# Altium schematic sheet ESP32-WROOM.SchDoc
size A4
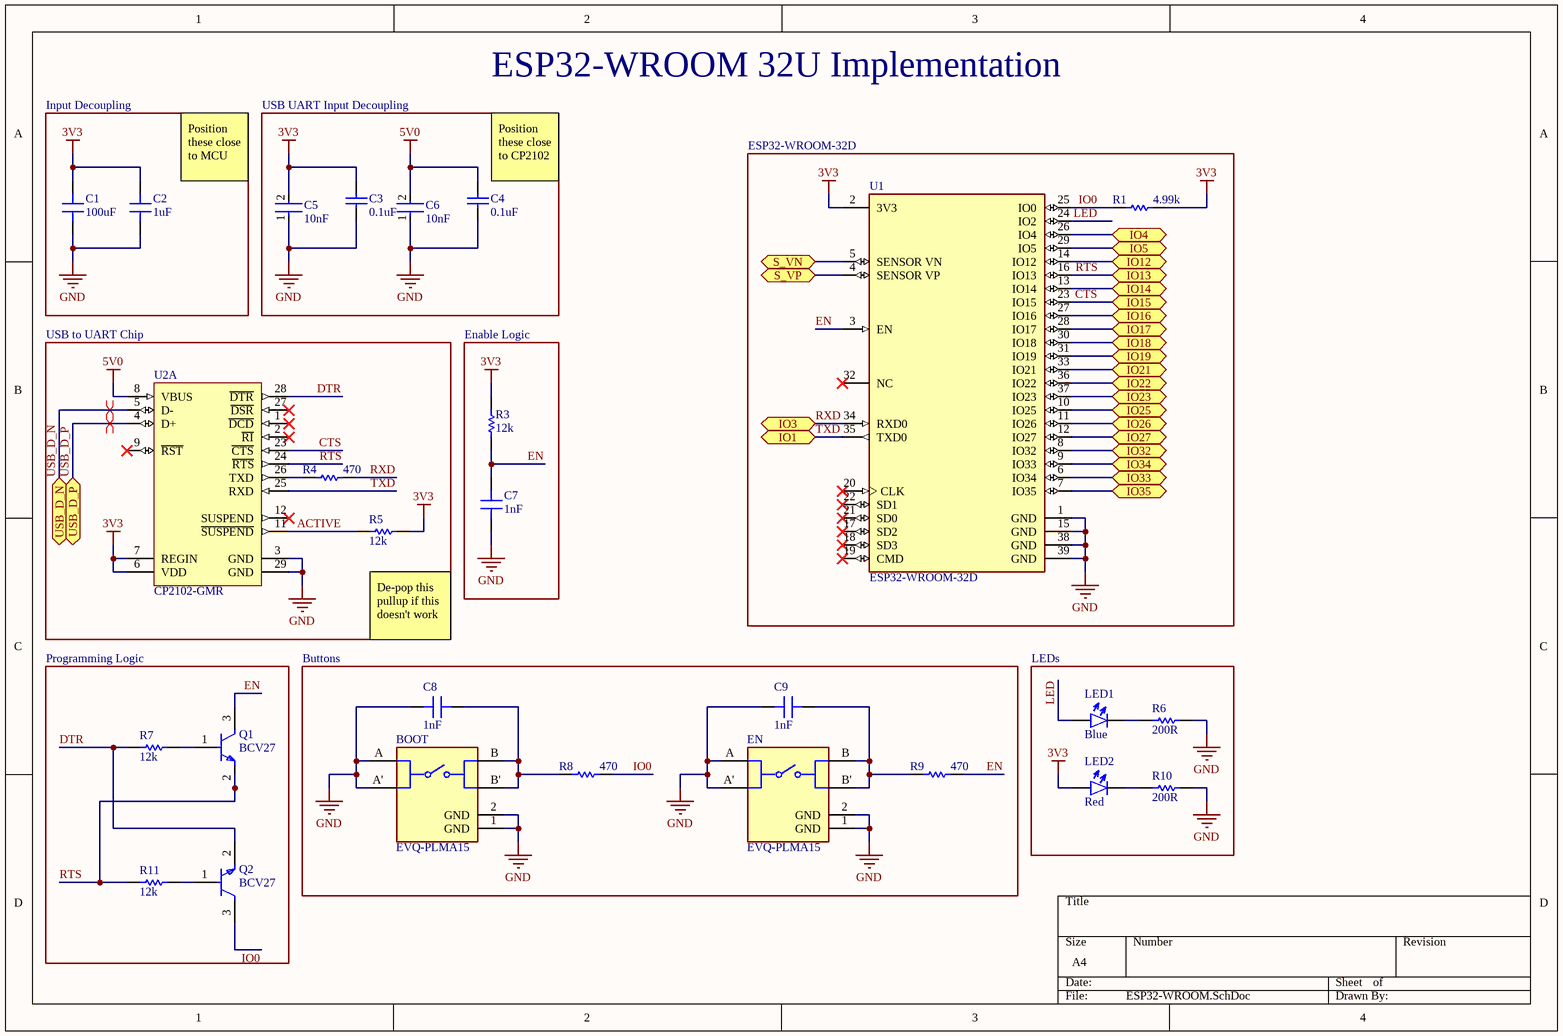
[diagram p0: ESP32-WROOM.SchDoc]

## Parts
BOOT  EVQ-PLMA15  [FP-EVQ-PLMA15-MFG]
C1  100uF  [0805]
C2  1uF  [0805]
C3  0.1uF  [CAPC2013X88X50NL20T25]
C4  0.1uF  [CAPC2013X88X50NL20T25]
C5  10nF  [FP-CL21-IPC_A]
C6  10nF  [FP-CL21-IPC_A]
C7  1nF  [0805]
C8  1nF  [0805]
C9  1nF  [0805]
EN  EVQ-PLMA15  [FP-EVQ-PLMA15-MFG]
LED1  Blue  [0805]
LED2  Red  [0805]
Q1  BCV27  [FP-318-08-MFG]
Q2  BCV27  [FP-318-08-MFG]
R1  4.99k  [0805]
R3  12k  [0805]
R4  470  [0805]
R5  12k  [0805]
R6  200R  [0805]
R7  12k  [0805]
R8  470  [0805]
R9  470  [0805]
R10  200R  [0805]
R11  12k  [0805]
U1  ESP32-WROOM-32D  [FP-ESP32-WROOM-32D-MFG]
U2  CP2102-GMR  [SLAB-QFN-28-3125x3125TP_M]  (part A of 2)

## Blocks framed on the sheet
Input Decoupling: C1 C2
USB UART Input Decoupling: C3-C6
ESP32-WROOM-32D: R1 U1
USB to UART Chip: R4 R5 U2
Enable Logic: C7 R3
Programming Logic: Q1 Q2 R7 R11
Buttons: BOOT C8 C9 EN R8 R9
LEDs: LED1 LED2 R6 R10

## Ports
IO1 (bidir), IO3 (bidir), IO4 (bidir), IO5 (bidir), IO12 (bidir), IO13 (bidir), IO14 (bidir), IO15 (bidir), IO16 (bidir), IO17 (bidir), IO18 (bidir), IO19 (bidir), IO21 (bidir), IO22 (bidir), IO23 (bidir), IO25 (bidir), IO26 (bidir), IO27 (bidir), IO32 (bidir), IO33 (bidir), IO34 (bidir), IO35 (bidir), S_VN (bidir), S_VP (bidir), USB_D_N (bidir), USB_D_P (bidir)

## Nets
3V3: C1.2 C2.2 C3.2 C5.2 LED2.1 R1.2 R3.2 R5.2 U1.2(3V3) U2.6(VDD) U2.7(REGIN)
5V0: C4.2 C6.2 U2.8(VBUS)
GND: BOOT.1(GND) BOOT.2(GND) BOOT.A BOOT.A' C1.1 C2.1 C3.1 C4.1 C5.1 C6.1 C7.1 C8.1 C9.1 EN.1(GND) EN.2(GND) EN.A EN.A' R6.2 R10.2 U1.1(GND) U1.15(GND) U1.38(GND) U1.39(GND) U2.3(GND) U2.29(GND)
ACTIVE: R5.1 U2.11(~{SUSPEND})
CTS: U1.23(IO15) U2.23(~{CTS}) ; port IO15
DTR: Q2.2(E) R7.1 U2.28(~{DTR})
EN: C7.2 Q1.3(C) R3.1 R9.1 U1.3(EN)
IO0: Q2.3(C) R1.1 R8.1 U1.25(IO0)
IO4: U1.26(IO4) ; port IO4
IO5: U1.29(IO5) ; port IO5
IO12: U1.14(IO12) ; port IO12
IO14: U1.13(IO14) ; port IO14
IO16: U1.27(IO16) ; port IO16
IO17: U1.28(IO17) ; port IO17
IO18: U1.30(IO18) ; port IO18
IO19: U1.31(IO19) ; port IO19
IO21: U1.33(IO21) ; port IO21
IO22: U1.36(IO22) ; port IO22
IO23: U1.37(IO23) ; port IO23
IO25: U1.10(IO25) ; port IO25
IO26: U1.11(IO26) ; port IO26
IO27: U1.12(IO27) ; port IO27
IO32: U1.8(IO32) ; port IO32
IO33: U1.6(IO34) ; port IO33
IO34: U1.9(IO33) ; port IO34
IO35: U1.7(IO35) ; port IO35
LED: LED1.1 U1.24(IO2)
RTS: Q1.2(E) R11.1 U1.16(IO13) U2.24(~{RTS}) ; port IO13
RXD: R4.1 U1.34(RXD0) ; port IO3
S_VN: U1.5(SENSOR_VN) ; port S_VN
S_VP: U1.4(SENSOR_VP) ; port S_VP
TXD: U1.35(TXD0) U2.25(RXD) ; port IO1
USB_D_N: U2.5(D-) ; port USB_D_N
USB_D_P: U2.4(D+) ; port USB_D_P
NetBOOT_B: BOOT.B BOOT.B' C8.2 R8.2
NetC9_2: C9.2 EN.B EN.B' R9.2
NetLED1_2: LED1.2 R6.1
NetLED2_2: LED2.2 R10.1
NetQ1_1: Q1.1(B) R7.2
NetQ2_1: Q2.1(B) R11.2
NetR4_2: R4.2 U2.26(TXD)

Not connected (* = marked no-connect by the designer): U1 17(SD2)* 18(SD3)* 19(CMD)* 20(CLK)* 21(SD0)* 22(SD1)* 32(NC)*; U2 1(~{DCD})* 2(~{RI})* 9(~{RST})* 12(SUSPEND)* 27(~{DSR})*

## Layout directives
differential pair: USB_D_N, USB_D_P

## Notes on the sheet
- ESP32-WROOM 32U Implementation
- Position these close to MCU
- (near C4) Position these close to CP2102
- (near R5) De-pop this pullup if this doesn't work

## Library data of the parts
BOOT EN = CMP-05618-000006-1: SWITCH TACTILE SPST-NO 0.02A 15V; Manufacturer: Panasonic Electronic Components; Operating Force: 2.6N; Contact Resistance: 50mΩ; Contact Current Rating: 20mA; Electromechanical Life: 200000Cycles; Illumination Type: Non-Illuminated,Illuminated; Switch Function: Off-Mom; Switch Travel: 0.25mm; Actuator Type: Standard; Insulation Resistance: 50MR; Actuator Length: 0.3mm; Throw Configuration: SPST-NO; Automotive: No; Digikey Description: SWITCH TACTILE SPST-NO 0.02A 15V; Device Class L3: Tactile Switches; Device Class L2: Switches; Temperature Range Low: -20°C; ComponentLink2Description: Datasheet; RoHS: TRUE; Mount: Surface Mount; Package: 0; Height: 1.7mm; Octopart: https://octopart.com/evq-plma15-panasonic-39850235; Temperature Range High: +70°C; Device Class L1: Electromechanical; Category: Switch; Mouser Description: Tactile Switches FLAT ACT 2.6NF 4.6x3.4x1.5mm; Voltage Rating Dc: 15V; Manufacturer Part Number: EVQ-PLMA15; ComponentLink2URL: https://datasheet.ciiva.com/8164/atv0000ce2-8164994.pdf; Lead Free: Yes; Temperature: -20°C to +70°C; Supplier 1: LCSC; Supplier Part Number 1: C128538; Stock 1: 8546; Pricing 1: 1=0.21470, 10=0.16010, 30=0.15000, 100=0.14000, 500=0.13560, 1000=0.13340, 1=0.20650, 10=0.15390, 30=0.14430, 100=0.13470, 500=0.13040, 1000=0.12830, 1=1.06470, 10=0.79390, 30=0.74410, 100=0.69450, 500=0.67240, 1000=0.66140, 1=0.98240, 10=0.73260, 30=0.68660, 100=0.64080, 500=0.62040, 1000=0.61030, 1=0.13200, 10=0.09850, 30=0.09230, 100=0.08610, 500=0.08340, 1000=0.08200, 1=0.12220, 10=0.09110, 30=0.08540, 100=0.07970, 500=0.07720, 1000=0.07590, 1=1.21530, 10=0.90620, 30=0.84940, 100=0.79270, 500=0.76750, 1000=0.75500, 1=16.57020, 10=12.35580, 30=11.58100, 100=10.80780, 500=10.46440, 1000=10.29370, 1=0.64910, 10=0.48400, 30=0.45370, 100=0.42340, 500=0.40990, 1000=0.40330, 1=11.79630, 10=8.79610, 30=8.24450, 100=7.69410, 500=7.44960, 1000=7.32800, 1=1.37520, 10=1.02550, 30=0.96110, 100=0.89700, 500=0.86850, 1000=0.85430, 1=0.21370, 10=0.15930, 30=0.14930, 100=0.13940, 500=0.13490, 1000=0.13270, 1=0.15682, 10=0.11693, 30=0.10960, 100=0.10228, 500=0.09903, 1000=0.09742 (AUD); Mechanical Life: 200000Cycles; Contact Plating: Gold,Silver; Min Operating Temperature: -20°C; Max Operating Temperature: 70°C; Packaging: Tape and Reel; Voltage Rating (DC): 15V; Package Quantity: 1; Max Voltage Rating (DC): 15V; Termination: J-Bend; Orientation: Straight; Current Rating: 20mA; Max Current Rating: 20mA; Electrical Life: 200000Cycles; Voltage Rating: 15V; Length: 4.9mm; Depth: 4.9mm; Width: 4.9mm; Radiation Hardening: No; REACH SVHC: No SVHC; ComponentLink1URL: https://datasheet.ciiva.com/8164/atv0000ce2-8164994.pdf?src-supplier=Avnet; ComponentLink1Description: https://datasheet.ciiva.com/8164/atv0000ce2-8164994.pdf?src-supplier=Avnet; ComponentLink3URL: https://datasheet.ciiva.com/16205/atk0000ce3-16205767.pdf?src-supplier=Future+Electronics; ComponentLink3Description: https://datasheet.ciiva.com/16205/atk0000ce3-16205767.pdf?src-supplier=Future+Electronics; ComponentLink4URL: https://datasheet.ciiva.com/17065/70270715-17065721.pdf?src-supplier=Allied+Electronics; ComponentLink4Description: https://datasheet.ciiva.com/17065/70270715-17065721.pdf?src-supplier=Allied+Electronics; ComponentLink5URL: https://datasheet.ciiva.com/2899/atk0000ce3-2899834.pdf?src-supplier=Digi-Key; ComponentLink5Description: https://datasheet.ciiva.com/2899/atk0000ce3-2899834.pdf?src-supplier=Digi-Key; ComponentLink6URL: https://datasheet.ciiva.com/2899/atk0000ce3-2899836.pdf?src-supplier=Digi-Key; ComponentLink6Description: https://datasheet.ciiva.com/2899/atk0000ce3-2899836.pdf?src-supplier=Digi-Key; ComponentLink7URL: https://datasheet.ciiva.com/26827/getdatasheetpartid-51835-26827884.pdf?src-supplier=Verical; ComponentLink7Description: https://datasheet.ciiva.com/26827/getdatasheetpartid-51835-26827884.pdf?src-supplier=Verical; ComponentLink8URL: https://datasheet.ciiva.com/2899/atk0000ce3-2899835.pdf?src-supplier=Digi-Key; ComponentLink8Description: https://datasheet.ciiva.com/2899/atk0000ce3-2899835.pdf?src-supplier=Digi-Key; Supplier 2: Digi-Key; Supplier Part Number 2: P8047SCT-ND; Stock 2: 25001; Pricing 2: 1=0.36000, 10=0.35000, 25=0.32920, 100=0.28580, 250=0.25928, 500=0.24120, 1000=0.21708, 2500=0.20382 (USD)
C1 = Capacitor - Ceramic: MURATA - GRM31CR60J107ME39L - SMD Multilayer Ceramic Capacitor, 100 µF, 6.3 V, 1206 [3216 Metric], ± 20%, X5R, GRM Series; Voltage Rating: 6.3V; Value: 100uF; Supplier 1: LCSC; Supplier Part Number 1: C77085; Manufacturer: Murata; Manufacturer Part Number: GRM31CR60J107ME39L; RoHS: Yes; Category: Ceramic Capacitors; Stock 1: 51728; Pricing 1: 1=0.20990, 10=0.15190, 30=0.14130, 100=0.13070, 500=0.12590, 1000=0.12360, 1=0.20040, 10=0.14510, 30=0.13490, 100=0.12480, 500=0.12030, 1000=0.11800, 1=1.02030, 10=0.73860, 30=0.68690, 100=0.63510, 500=0.61220, 1000=0.60080, 1=0.94960, 10=0.68740, 30=0.63930, 100=0.59110, 500=0.56970, 1000=0.55920, 1=0.12750, 10=0.09230, 30=0.08590, 100=0.07940, 500=0.07650, 1000=0.07510, 1=0.11640, 10=0.08430, 30=0.07840, 100=0.07250, 500=0.06990, 1000=0.06860, 1=1.16060, 10=0.84010, 30=0.78140, 100=0.72250, 500=0.69640, 1000=0.68340, 1=15.82710, 10=11.45680, 30=10.65540, 100=9.85210, 500=9.49630, 1000=9.32010, 1=0.62240, 10=0.45060, 30=0.41900, 100=0.38750, 500=0.37350, 1000=0.36650, 1=11.81250, 10=8.55070, 30=7.95260, 100=7.35310, 500=7.08750, 1000=6.95600, 1=1.34210, 10=0.97150, 30=0.90360, 100=0.83540, 500=0.80530, 1000=0.79030, 1=0.20480, 10=0.14830, 30=0.13790, 100=0.12750, 500=0.12290, 1000=0.12060, 1=0.14975, 10=0.10840, 30=0.10082, 100=0.09322, 500=0.08985, 1000=0.08818 (AUD); Mount: Surface Mount; Case/Package: 1206; Case Code (Imperial): 1206; Case Code (Metric): 3216; Material: Ceramic; Min Operating Temperature: -55°C; Max Operating Temperature: 85°C; Capacitance: 100uF; Tolerance: 20%; Packaging: Tape and Reel; Voltage Rating (DC): 6.3V; Package Quantity: 1; Termination: SMD/SMT; Voltage: 6.3V; Dielectric: X5R; Length: 3.2mm; Height: 1.6mm; Width: 1.6mm; Depth: 1.6mm; Thickness: 0.071inch; Radiation Hardening: No; REACH SVHC: No SVHC; Lead Free: Lead Free; ComponentLink1URL: https://datasheet.ciiva.com/11787/0900766b80ef921d-11787809.pdf?src-supplier=RSComponents; ComponentLink1Description: https://datasheet.ciiva.com/11787/0900766b80ef921d-11787809.pdf?src-supplier=RSComponents; ComponentLink2URL: https://datasheet.ciiva.com/142/grm31cr60j107me39-01-142571.pdf?src-supplier=Digi-Key; ComponentLink2Description: https://datasheet.ciiva.com/142/grm31cr60j107me39-01-142571.pdf?src-supplier=Digi-Key; ComponentLink3URL: https://datasheet.ciiva.com/142/grm31cr60j107me39-01-142572.pdf?src-supplier=Digi-Key; ComponentLink3Description: https://datasheet.ciiva.com/142/grm31cr60j107me39-01-142572.pdf?src-supplier=Digi-Key; ComponentLink4URL: https://datasheet.ciiva.com/3776/255grm31cr60j107me3923-3776999.pdf?src-supplier=Arrow+Electronics; ComponentLink4Description: https://datasheet.ciiva.com/3776/255grm31cr60j107me3923-3776999.pdf?src-supplier=Arrow+Electronics; ComponentLink5URL: https://datasheet.ciiva.com/29199/454804-da-01-en-vs-kondensator-1206-29199543.pdf?src-supplier=Conrad; ComponentLink5Description: https://datasheet.ciiva.com/29199/454804-da-01-en-vs-kondensator-1206-29199543.pdf?src-supplier=Conrad; ComponentLink6URL: https://datasheet.ciiva.com/29202/451152-da-01-de-vs-chip-kond-1206-100-0-uf-20pr-6-3v-x5r-29202463.pdf?src-supplier=Conrad; ComponentLink6Description: https://datasheet.ciiva.com/29202/451152-da-01-de-vs-chip-kond-1206-100-0-uf-20pr-6-3v-x5r-29202463.pdf?src-supplier=Conrad; ComponentLink7URL: https://datasheet.ciiva.com/5416/product-5416441.pdf?src-supplier=Mouser; ComponentLink7Description: https://datasheet.ciiva.com/5416/product-5416441.pdf?src-supplier=Mouser; ComponentLink8URL: https://datasheet.ciiva.com/142/grm31cr60j107me39-01-142570.pdf?src-supplier=Digi-Key; ComponentLink8Description: https://datasheet.ciiva.com/142/grm31cr60j107me39-01-142570.pdf?src-supplier=Digi-Key; ComponentLink9URL: https://datasheet.ciiva.com/16461/product-16461259.pdf?src-supplier=Future+Electronics; ComponentLink9Description: https://datasheet.ciiva.com/16461/product-16461259.pdf?src-supplier=Future+Electronics; ComponentLink10URL: https://datasheet.ciiva.com/14116/grmseries-highdielectrictype-eng-14116431.pdf?src-supplier=Distrelec; ComponentLink10Description: https://datasheet.ciiva.com/14116/grmseries-highdielectrictype-eng-14116431.pdf?src-supplier=Distrelec; Supplier 2: Digi-Key; Supplier Part Number 2: 490-4539-1-ND; Stock 2: 1324719; Pricing 2: 1=0.86000, 10=0.65200, 50=0.54180, 100=0.46650, 500=0.36118, 1000=0.31101 (USD)
C2 = Capacitor - Ceramic: SAMSUNG ELECTRO-MECHANICS - CL21B105KOFNNNE - CERAMIC MULTILAYER MLCC CAPACITORS- SMD; Tolerance: 10%; Voltage Rating: 16V; Dielectric: X7R; Value: 1uF; Supplier 1: LCSC; Supplier Part Number 1: C24123; Manufacturer: Samsung; Manufacturer Part Number: CL21B105KOFNNNE; RoHS: Yes; Category: Ceramic Capacitors; Stock 1: 77650; Pricing 1: 50=0.02130, 500=0.01590, 1500=0.01490, 5000=0.01400, 25000=0.01350, 50000=0.01330, 50=0.02010, 500=0.01500, 1500=0.01410, 5000=0.01310, 25000=0.01270, 50000=0.01250, 50=0.10220, 500=0.07640, 1500=0.07170, 5000=0.06700, 25000=0.06480, 50000=0.06380, 50=0.09590, 500=0.07170, 1500=0.06720, 5000=0.06280, 25000=0.06080, 50000=0.05990, 50=0.01290, 500=0.00960, 1500=0.00900, 5000=0.00840, 25000=0.00820, 50000=0.00800, 50=0.01180, 500=0.00880, 1500=0.00820, 5000=0.00770, 25000=0.00750, 50000=0.00730, 50=0.11610, 500=0.08680, 1500=0.08140, 5000=0.07600, 25000=0.07360, 50000=0.07250, 50=1.58180, 500=1.18260, 1500=1.10930, 5000=1.03610, 25000=1.00340, 50000=0.98740, 50=0.06250, 500=0.04670, 1500=0.04380, 5000=0.04090, 25000=0.03960, 50000=0.03900, 50=1.17060, 500=0.87520, 1500=0.82100, 5000=0.76680, 25000=0.74260, 50000=0.73080, 50=0.13680, 500=0.10230, 1500=0.09600, 5000=0.08960, 25000=0.08680, 50000=0.08540, 50=0.02060, 500=0.01540, 1500=0.01450, 5000=0.01350, 25000=0.01310, 50000=0.01290, 50=0.01498, 500=0.01120, 1500=0.01051, 5000=0.00981, 25000=0.00950, 50000=0.00935 (AUD); Mount: Surface Mount; Case/Package: 0805; Case Code (Metric): 2012; Case Code (Imperial): 0805; Contact Plating: Tin; Min Operating Temperature: -55°C; Max Operating Temperature: 125°C; Package Quantity: 1; Packaging: Tape and Reel; Capacitance: 1uF; Voltage Rating (DC): 16V; Voltage: 16V; Length: 2mm; Height: 1.25mm; Width: 0.049inch; Depth: 1.25mm; Thickness: 0.053inch; Radiation Hardening: No; Lead Free: Lead Free; ComponentLink1URL: https://datasheet.ciiva.com/25800/cl21b105kofnnne-25800257.pdf?src-supplier=Digi-Key; ComponentLink1Description: https://datasheet.ciiva.com/25800/cl21b105kofnnne-25800257.pdf?src-supplier=Digi-Key; ComponentLink2URL: https://datasheet.ciiva.com/26838/getdatasheetpartid-358361-26838673.pdf?src-supplier=Verical; ComponentLink2Description: https://datasheet.ciiva.com/26838/getdatasheetpartid-358361-26838673.pdf?src-supplier=Verical; ComponentLink3URL: https://datasheet.ciiva.com/26310/mlcc-catalogdownload2013-eng-26310166.pdf?src-supplier=Distrelec; ComponentLink3Description: https://datasheet.ciiva.com/26310/mlcc-catalogdownload2013-eng-26310166.pdf?src-supplier=Distrelec; Supplier 2: Digi-Key; Supplier Part Number 2: 1276-1026-1-ND; Stock 2: 1444; Pricing 2: 1=0.10000, 10=0.05500, 50=0.03000, 100=0.02450, 500=0.01748, 1000=0.01373 (USD)
C3 C4 = CMP-2007-00279-1: Part Number: C0805C104K5RACTU; Manufacturer: Kemet; Dielectric Material: Ceramic; Capacitance: 100nF; Tolerance: 10%; Voltage Rating: 50V; Dielectric: X7R; Voltage: 500V; Supplier 1: LCSC; Supplier Part Number 1: C129690; Manufacturer Part Number: C0805C104K5RACTU; RoHS: Yes; Category: Ceramic Capacitors; Stock 1: 744050; Pricing 1: 50=0.02360, 500=0.01780, 1500=0.01680, 5000=0.01570, 25000=0.01530, 50000=0.01500, 50=0.02250, 500=0.01700, 1500=0.01600, 5000=0.01500, 25000=0.01460, 50000=0.01430, 50=0.11760, 500=0.08890, 1500=0.08370, 5000=0.07840, 25000=0.07610, 50000=0.07490, 50=0.10700, 500=0.08090, 1500=0.07610, 5000=0.07130, 25000=0.06920, 50000=0.06810, 50=0.01440, 500=0.01090, 1500=0.01020, 5000=0.00960, 25000=0.00930, 50000=0.00920, 50=0.01310, 500=0.00990, 1500=0.00930, 5000=0.00870, 25000=0.00850, 50000=0.00830, 50=0.13020, 500=0.09850, 1500=0.09270, 5000=0.08680, 25000=0.08420, 50000=0.08300, 50=1.77600, 500=1.34310, 1500=1.26360, 5000=1.18400, 25000=1.14870, 50000=1.13130, 50=0.07150, 500=0.05410, 1500=0.05090, 5000=0.04770, 25000=0.04620, 50000=0.04550, 50=1.20420, 500=0.91060, 1500=0.85670, 5000=0.80280, 25000=0.77880, 50000=0.76700, 50=0.14790, 500=0.11180, 1500=0.10520, 5000=0.09860, 25000=0.09570, 50000=0.09420, 50=0.02320, 500=0.01750, 1500=0.01650, 5000=0.01550, 25000=0.01500, 50000=0.01480, 50=0.01680, 500=0.01271, 1500=0.01196, 5000=0.01120, 25000=0.01087, 50000=0.01070 (AUD); Mount: Surface Mount,PCB; Case/Package: 0805; Number of Pins: 2; Case Code (Imperial): 0805; Case Code (Metric): 2012; Contact Plating: Tin,Matte; Min Operating Temperature: -55°C; Max Operating Temperature: 125°C; Packaging: Tape and Reel; Termination: SMD/SMT; Package Quantity: 4000; Voltage Rating (DC): 50V; Length: 2mm; Height: 0.9mm; Depth: 1.25mm; Width: 1.2mm; Thickness: 0.035inch; Lead Pitch: 0.75mm; Radiation Hardening: No; REACH SVHC: No SVHC; ComponentLink1URL: https://datasheet.ciiva.com/14589/70095383-14589048.pdf?src-supplier=Allied+Electronics; ComponentLink1Description: https://datasheet.ciiva.com/14589/70095383-14589048.pdf?src-supplier=Allied+Electronics; ComponentLink2URL: https://datasheet.ciiva.com/28682/1851736-28682232.pdf?src-supplier=Element14; ComponentLink2Description: https://datasheet.ciiva.com/28682/1851736-28682232.pdf?src-supplier=Element14; ComponentLink3URL: https://datasheet.ciiva.com/32431/slceramic-chip-condensers-e-32431755.pdf?src-supplier=Distrelec; ComponentLink3Description: https://datasheet.ciiva.com/32431/slceramic-chip-condensers-e-32431755.pdf?src-supplier=Distrelec; ComponentLink4URL: https://datasheet.ciiva.com/18410/70095383-18410815.pdf?src-supplier=Allied+Electronics; ComponentLink4Description: https://datasheet.ciiva.com/18410/70095383-18410815.pdf?src-supplier=Allied+Electronics; Supplier 2: Digi-Key; Supplier Part Number 2: 399-1170-1-ND; Stock 2: 2736847; Pricing 2: 1=0.16000, 10=0.11500, 50=0.06540, 100=0.05420, 500=0.03802, 1000=0.03147 (USD)
C5 C6 = CMP-13271-003077-1: CL21 Series 0805 10nF 100V ±10% Tolerance X7R Multilayer Ceramic Chip Capacitor; Manufacturer: Samsung; Manufacturer Part Number: CL21B103KCANNNC; Voltage: 100V; Contact Plating: Tin; Height: 0.65mm; Thickness: 0.03inch; Min Operating Temperature: -55°C; Capacitance: 10nF; Length: 2mm; Max Operating Temperature: 125°C; Case Code (Imperial): 0805; Radiation Hardening: No; Dielectric: X7R; Material: Ceramic; Depth: 1.25mm; Voltage Rating: 100V; Case/Package: 0805; Tolerance: 10%; Package Quantity: 1; Width: 0.049inch; Mount: Surface Mount; Case Code (Metric): 2012; Packaging: Tape and Reel; Supplier 1: LCSC; Supplier Part Number 1: C18741; RoHS: Yes; Category: Ceramic Capacitors; Stock 1: 16900; Pricing 1: 50=0.01480, 500=0.01090, 1500=0.01020, 5000=0.00950, 25000=0.00920, 50000=0.00910, 50=0.01420, 500=0.01050, 1500=0.00990, 5000=0.00920, 25000=0.00890, 50000=0.00870, 50=0.07310, 500=0.05410, 1500=0.05060, 5000=0.04710, 25000=0.04560, 50000=0.04480, 50=0.06800, 500=0.05030, 1500=0.04700, 5000=0.04380, 25000=0.04230, 50000=0.04160, 50=0.00910, 500=0.00680, 1500=0.00630, 5000=0.00590, 25000=0.00570, 50000=0.00560, 50=0.00840, 500=0.00620, 1500=0.00580, 5000=0.00540, 25000=0.00520, 50000=0.00510, 50=0.08390, 500=0.06200, 1500=0.05800, 5000=0.05400, 25000=0.05230, 50000=0.05140, 50=1.13470, 500=0.83950, 1500=0.78530, 5000=0.73100, 25000=0.70690, 50000=0.69500, 50=0.04470, 500=0.03300, 1500=0.03090, 5000=0.02880, 25000=0.02780, 50000=0.02740, 50=0.81170, 500=0.60050, 1500=0.56170, 5000=0.52290, 25000=0.50570, 50000=0.49710, 50=0.09500, 500=0.07020, 1500=0.06570, 5000=0.06120, 25000=0.05920, 50000=0.05820, 50=0.01470, 500=0.01090, 1500=0.01020, 5000=0.00950, 25000=0.00910, 50000=0.00900, 50=0.01082, 500=0.00801, 1500=0.00749, 5000=0.00697, 25000=0.00674, 50000=0.00663 (AUD); ComponentLink1URL: https://datasheet.ciiva.com/15195/getdatasheetpartid-494350-15195869.pdf?src-supplier=Verical; ComponentLink1Description: https://datasheet.ciiva.com/15195/getdatasheetpartid-494350-15195869.pdf?src-supplier=Verical; ComponentLink2URL: https://datasheet.ciiva.com/29199/455069-da-01-en-vs-kondensator-0805-29199454.pdf?src-supplier=Conrad; ComponentLink2Description: https://datasheet.ciiva.com/29199/455069-da-01-en-vs-kondensator-0805-29199454.pdf?src-supplier=Conrad; ComponentLink3URL: https://datasheet.ciiva.com/26310/mlcc-catalogdownload2013-eng-26310214.pdf?src-supplier=Distrelec; ComponentLink3Description: https://datasheet.ciiva.com/26310/mlcc-catalogdownload2013-eng-26310214.pdf?src-supplier=Distrelec; ComponentLink4URL: https://datasheet.ciiva.com/16351/cl21b103kcannnc-16351132.pdf?src-supplier=Future+Electronics; ComponentLink4Description: https://datasheet.ciiva.com/16351/cl21b103kcannnc-16351132.pdf?src-supplier=Future+Electronics; Supplier 2: Digi-Key; Supplier Part Number 2: 1276-1249-1-ND; Stock 2: 123647; Pricing 2: 1=0.10000, 10=0.03900, 50=0.02140, 100=0.01740, 500=0.01244, 1000=0.00977 (USD)
C7-C9 = Capacitor - Ceramic: SAMSUNG ELECTRO-MECHANICS - CL21B102KCANNNC - SMD Multilayer Ceramic Capacitor, 1000 pF, 100 V, 0805 [2012 Metric], ± 10%, X7R, CL Series; Voltage Rating (DC): 100V; Value: 1nF; Supplier 1: LCSC; Supplier Part Number 1: C15177; Manufacturer: Samsung; Manufacturer Part Number: CL21B102KCANNNC; RoHS: Yes; Category: Ceramic Capacitors; Stock 1: 341000; Pricing 1: 50=0.01320, 500=0.00960, 1500=0.00900, 5000=0.00830, 25000=0.00800, 50000=0.00790, 50=0.01240, 500=0.00910, 1500=0.00840, 5000=0.00780, 25000=0.00750, 50000=0.00740, 50=0.06330, 500=0.04620, 1500=0.04300, 5000=0.03990, 25000=0.03850, 50000=0.03780, 50=0.05940, 500=0.04330, 1500=0.04030, 5000=0.03740, 25000=0.03610, 50000=0.03540, 50=0.00800, 500=0.00580, 1500=0.00540, 5000=0.00500, 25000=0.00480, 50000=0.00480, 50=0.00730, 500=0.00530, 1500=0.00490, 5000=0.00460, 25000=0.00440, 50000=0.00430, 50=0.07190, 500=0.05240, 1500=0.04890, 5000=0.04530, 25000=0.04370, 50000=0.04290, 50=0.97930, 500=0.71430, 1500=0.66560, 5000=0.61710, 25000=0.59540, 50000=0.58480, 50=0.03870, 500=0.02820, 1500=0.02630, 5000=0.02440, 25000=0.02350, 50000=0.02310, 50=0.72470, 500=0.52870, 1500=0.49260, 5000=0.45670, 25000=0.44070, 50000=0.43280, 50=0.08470, 500=0.06180, 1500=0.05760, 5000=0.05340, 25000=0.05150, 50000=0.05060, 50=0.01280, 500=0.00930, 1500=0.00870, 5000=0.00810, 25000=0.00780, 50000=0.00760, 50=0.00927, 500=0.00677, 1500=0.00630, 5000=0.00584, 25000=0.00564, 50000=0.00554 (AUD); Mount: Surface Mount; Case/Package: 0805; Case Code (Metric): 2012; Case Code (Imperial): 0805; Material: Ceramic; Min Operating Temperature: -55°C; Max Operating Temperature: 125°C; Dielectric: X7R; Tolerance: 10%; Packaging: Tape and Reel; Capacitance: 1nF; Voltage Rating: 100V; Package Quantity: 1; Voltage: 100V; Length: 2mm; Height: 0.65mm; Depth: 1.25mm; Thickness: 0.03inch; Width: 0.049inch; Radiation Hardening: No; Lead Free: Lead Free; ComponentLink1URL: https://datasheet.ciiva.com/26878/getdatasheetpartid-643098-26878049.pdf?src-supplier=Verical; ComponentLink1Description: https://datasheet.ciiva.com/26878/getdatasheetpartid-643098-26878049.pdf?src-supplier=Verical; ComponentLink2URL: https://datasheet.ciiva.com/29199/456063-da-01-en-vs-kondensator-0805-29199067.pdf?src-supplier=Conrad; ComponentLink2Description: https://datasheet.ciiva.com/29199/456063-da-01-en-vs-kondensator-0805-29199067.pdf?src-supplier=Conrad; ComponentLink3URL: https://datasheet.ciiva.com/26310/mlcc-catalogdownload2013-eng-26310183.pdf?src-supplier=Distrelec; ComponentLink3Description: https://datasheet.ciiva.com/26310/mlcc-catalogdownload2013-eng-26310183.pdf?src-supplier=Distrelec; Supplier 2: Digi-Key; Supplier Part Number 2: 1276-1169-1-ND; Stock 2: 91657; Pricing 2: 1=0.10000, 10=0.04700, 50=0.02540, 100=0.02080, 500=0.01482, 1000=0.01165 (USD)
LED1 = LED: Forward Voltage: 2.7; Current: 20mA; Color: Blue; Supplier 1: LCSC; Supplier Part Number 1: C84259
LED2 = LED: Forward Voltage: 2.4; Current: 25; Color: Red; Supplier 1: LCSC; Supplier Part Number 1: C72037
Q1 Q2 = CMP-07170-000025-1: TRANS NPN DARL 30V 1.2A SOT23; Manufacturer: ON Semiconductor / Fairchild; Max Power Dissipation: 350mW; Emitter Base Voltage (VEBO): 10V; Transition Frequency: 220MHz; Number of Elements: 1; Collector Base Voltage (VCBO): 40V; Collector Emitter Saturation Voltage: 1V; Element Configuration: Single; hFE Min: 10000; Lead Free: Lead Free; Height: 0.93mm; Number of Pins: 3; Width: 1.3mm; Mount: Surface Mount; Max Collector Current: 1.2A; Max Operating Temperature: 150°C; Voltage Rating (DC): 30V; Weight: 0.03g; Min Operating Temperature: -55°C; Collector Emitter Breakdown Voltage: 30V; Length: 2.92mm; Polarity: NPN; Package Quantity: 1; REACH SVHC: No SVHC; Case/Package: SOT-23; Contact Plating: Tin; Radiation Hardening: No; Collector Emitter Voltage (VCEO): 30V; Current Rating: 1.2A; Power Dissipation: 350mW; Packaging: Tape and Reel; Max Breakdown Voltage: 30V; Supplier 1: LCSC; Supplier Part Number 1: C258198; Manufacturer Part Number: BCV27; RoHS: Yes; Category: BJTs; Stock 1: 55620; Pricing 1: 10=0.06270, 100=0.04660, 300=0.04370, 1000=0.04070, 5000=0.03940, 10000=0.03880, 10=0.06030, 100=0.04490, 300=0.04200, 1000=0.03920, 5000=0.03790, 10000=0.03730, 10=0.31120, 100=0.23130, 300=0.21660, 1000=0.20190, 5000=0.19540, 10000=0.19220, 10=0.28720, 100=0.21340, 300=0.19990, 1000=0.18630, 5000=0.18030, 10000=0.17730, 10=0.03860, 100=0.02870, 300=0.02690, 1000=0.02500, 5000=0.02420, 10000=0.02380, 10=0.03570, 100=0.02650, 300=0.02490, 1000=0.02320, 5000=0.02240, 10000=0.02210, 10=0.35520, 100=0.26400, 300=0.24730, 1000=0.23050, 5000=0.22310, 10000=0.21940, 10=4.84350, 100=3.59970, 300=3.37140, 1000=3.14290, 5000=3.04140, 10000=2.99120, 10=0.18970, 100=0.14100, 300=0.13210, 1000=0.12310, 5000=0.11910, 10000=0.11720, 10=3.44810, 100=2.56260, 300=2.40010, 1000=2.23740, 5000=2.16520, 10000=2.12940, 10=0.40200, 100=0.29880, 300=0.27980, 1000=0.26080, 5000=0.25240, 10000=0.24820, 10=0.06250, 100=0.04640, 300=0.04350, 1000=0.04050, 5000=0.03920, 10000=0.03860, 10=0.04584, 100=0.03407, 300=0.03191, 1000=0.02974, 5000=0.02878, 10000=0.02831 (AUD); ComponentLink1URL: https://datasheet.ciiva.com/5770/276130-5770439.pdf?src-supplier=Farnell; ComponentLink1Description: https://datasheet.ciiva.com/5770/276130-5770439.pdf?src-supplier=Farnell; ComponentLink2URL: https://datasheet.ciiva.com/15140/getdatasheetpartid-251529-15140103.pdf?src-supplier=Verical; ComponentLink2Description: https://datasheet.ciiva.com/15140/getdatasheetpartid-251529-15140103.pdf?src-supplier=Verical; ComponentLink3URL: https://datasheet.ciiva.com/972/bcv27-972039.pdf?src-supplier=Digi-Key; ComponentLink3Description: https://datasheet.ciiva.com/972/bcv27-972039.pdf?src-supplier=Digi-Key; ComponentLink4URL: https://datasheet.ciiva.com/26229/bcv27-26229783.pdf?src-supplier=Avnet+Europe; ComponentLink4Description: https://datasheet.ciiva.com/26229/bcv27-26229783.pdf?src-supplier=Avnet+Europe; ComponentLink5URL: https://datasheet.ciiva.com/972/bcv27-972040.pdf?src-supplier=Digi-Key; ComponentLink5Description: https://datasheet.ciiva.com/972/bcv27-972040.pdf?src-supplier=Digi-Key; ComponentLink6URL: https://datasheet.ciiva.com/972/bcv27-972041.pdf?src-supplier=Digi-Key; ComponentLink6Description: https://datasheet.ciiva.com/972/bcv27-972041.pdf?src-supplier=Digi-Key; ComponentLink7URL: https://datasheet.ciiva.com/17017/bcv27-17017834.pdf?src-supplier=Future+Electronics; ComponentLink7Description: https://datasheet.ciiva.com/17017/bcv27-17017834.pdf?src-supplier=Future+Electronics; ComponentLink8URL: https://datasheet.ciiva.com/3303/bcv27-3303755.pdf?src-supplier=Avnet; ComponentLink8Description: https://datasheet.ciiva.com/3303/bcv27-3303755.pdf?src-supplier=Avnet; ComponentLink9URL: https://datasheet.ciiva.com/11211/bcv27-11211580.pdf?src-supplier=Avnet; ComponentLink9Description: https://datasheet.ciiva.com/11211/bcv27-11211580.pdf?src-supplier=Avnet; ComponentLink10URL: https://datasheet.ciiva.com/16471/bcv27-16471886.pdf?src-supplier=Avnet+Asia; ComponentLink10Description: https://datasheet.ciiva.com/16471/bcv27-16471886.pdf?src-supplier=Avnet+Asia; Supplier 2: Digi-Key; Supplier Part Number 2: BCV27CT-ND; Stock 2: 54597; Pricing 2: 1=0.30000, 10=0.24200, 25=0.20240, 100=0.09900, 500=0.08258, 1000=0.05738 (USD)
R1 = Resistor: Res Thick Film 2.0 x 1.2 mm 4.99K Ohm 1% 0.125W(1/8W) 100ppm/ C Molded SMD Punched Carrier T/R; Manufacturer: Panasonic; Manufacturer Part Number: ERJ6ENF4991V; Resistance: 4.99kR; Power Rating: 125mW; Voltage Rating: 150V; Temperature Coefficient: 100ppm/°C; Value: 4.99k; Supplier 1: LCSC; Supplier Part Number 1: C230651; RoHS: Yes; Category: Chip SMD Resistors; Stock 1: 400; Pricing 1: 50=0.01640, 500=0.01200, 1500=0.01120, 5000=0.01040, 25000=0.01010, 50000=0.00990, 50=0.01540, 500=0.01130, 1500=0.01060, 5000=0.00980, 25000=0.00950, 50000=0.00930, 50=0.07850, 500=0.05770, 1500=0.05380, 5000=0.05000, 25000=0.04830, 50000=0.04740, 50=0.07370, 500=0.05410, 1500=0.05050, 5000=0.04690, 25000=0.04530, 50000=0.04450, 50=0.00990, 500=0.00730, 1500=0.00680, 5000=0.00630, 25000=0.00610, 50000=0.00600, 50=0.00900, 500=0.00660, 1500=0.00620, 5000=0.00570, 25000=0.00560, 50000=0.00550, 50=0.08920, 500=0.06550, 1500=0.06110, 5000=0.05680, 25000=0.05480, 50000=0.05390, 50=1.21540, 500=0.89210, 1500=0.83280, 5000=0.77350, 25000=0.74710, 50000=0.73410, 50=0.04800, 500=0.03520, 1500=0.03290, 5000=0.03060, 25000=0.02950, 50000=0.02900, 50=0.89950, 500=0.66030, 1500=0.61630, 5000=0.57240, 25000=0.55290, 50000=0.54330, 50=0.10510, 500=0.07720, 1500=0.07200, 5000=0.06690, 25000=0.06460, 50000=0.06350, 50=0.01590, 500=0.01160, 1500=0.01090, 5000=0.01010, 25000=0.00980, 50000=0.00960, 50=0.01151, 500=0.00845, 1500=0.00789, 5000=0.00733, 25000=0.00708, 50000=0.00695 (AUD); Mount: Surface Mount; Case/Package: 0805; Case Code (Metric): 2012; Case Code (Imperial): 0805; Contact Plating: Tin; Min Operating Temperature: -55°C; Max Operating Temperature: 155°C; Packaging: Tape and Reel; Tolerance: 1%; Resistor Type: Thick Film; Termination: SMD/SMT; Number of Terminations: 2; Package Quantity: 5000; Voltage Rating (DC): 150V; Max Power Dissipation: 125mW; Features: Automotive AEC-Q200; Length: 2mm; Height: 0.028inch; Width: 0.049inch; Depth: 1.25mm; Radiation Hardening: No; Lead Free: Lead Free; REACH SVHC: No SVHC; Military Standard: Not; ComponentLink1URL: https://datasheet.ciiva.com/34303/1989391-34303637.pdf?src-supplier=Jameco; ComponentLink1Description: https://datasheet.ciiva.com/34303/1989391-34303637.pdf?src-supplier=Jameco; ComponentLink2URL: https://datasheet.ciiva.com/46376/426256-46376934.pdf?src-supplier=Element14; ComponentLink2Description: https://datasheet.ciiva.com/46376/426256-46376934.pdf?src-supplier=Element14; ComponentLink3URL: https://datasheet.ciiva.com/24024/aoa0000ce2-24024238.pdf?src-supplier=Mouser; ComponentLink3Description: https://datasheet.ciiva.com/24024/aoa0000ce2-24024238.pdf?src-supplier=Mouser; ComponentLink4URL: https://datasheet.ciiva.com/16772/70260748-16772950.pdf?src-supplier=Allied+Electronics; ComponentLink4Description: https://datasheet.ciiva.com/16772/70260748-16772950.pdf?src-supplier=Allied+Electronics; ComponentLink5URL: https://datasheet.ciiva.com/30192/aoa0000ce2-30192794.pdf?src-supplier=Onlinecomponents.com; ComponentLink5Description: https://datasheet.ciiva.com/30192/aoa0000ce2-30192794.pdf?src-supplier=Onlinecomponents.com; ComponentLink6URL: https://datasheet.ciiva.com/9195/aoa0000ce2-9195611.pdf?src-supplier=Avnet; ComponentLink6Description: https://datasheet.ciiva.com/9195/aoa0000ce2-9195611.pdf?src-supplier=Avnet; ComponentLink7URL: https://datasheet.ciiva.com/46388/426256-46388331.pdf?src-supplier=Element14; ComponentLink7Description: https://datasheet.ciiva.com/46388/426256-46388331.pdf?src-supplier=Element14; ComponentLink8URL: https://datasheet.ciiva.com/16371/aoa0000ce2-16371503.pdf?src-supplier=Future+Electronics; ComponentLink8Description: https://datasheet.ciiva.com/16371/aoa0000ce2-16371503.pdf?src-supplier=Future+Electronics; Supplier 2: Digi-Key; Supplier Part Number 2: P4.99KCCT-ND; Stock 2: 370270; Pricing 2: 1=0.10000, 10=0.06500, 100=0.02500, 1000=0.01100, 2500=0.00950 (USD)
R3 R5 R7 R11 = Resistor: Res Thick Film 0805 12K Ohm 1% 1/8W 100ppm/C Molded SMD SMD Paper Tape on Plastic Reel; Manufacturer: Bourns; Manufacturer Part Number: CR0805-FX-1202ELF; Temperature Coefficient: 100ppm/°C; Resistance: 12kR; Power Rating: 125mW; Voltage Rating: 150V; Value: 12k; Supplier 1: LCSC; Supplier Part Number 1: C204186; RoHS: Yes; Category: Chip SMD Resistors; Stock 1: 105750; Pricing 1: 50=0.01460, 500=0.01070, 1500=0.01000, 5000=0.00920, 25000=0.00890, 50000=0.00880, 50=0.01390, 500=0.01020, 1500=0.00950, 5000=0.00880, 25000=0.00850, 50000=0.00840, 50=0.07100, 500=0.05190, 1500=0.04840, 5000=0.04490, 25000=0.04330, 50000=0.04260, 50=0.06600, 500=0.04830, 1500=0.04500, 5000=0.04180, 25000=0.04030, 50000=0.03960, 50=0.00890, 500=0.00650, 1500=0.00600, 5000=0.00560, 25000=0.00540, 50000=0.00530, 50=0.00810, 500=0.00590, 1500=0.00550, 5000=0.00510, 25000=0.00490, 50000=0.00490, 50=0.08070, 500=0.05900, 1500=0.05510, 5000=0.05110, 25000=0.04930, 50000=0.04840, 50=1.10080, 500=0.80500, 1500=0.75070, 5000=0.69640, 25000=0.67230, 50000=0.66040, 50=0.04330, 500=0.03170, 1500=0.02950, 5000=0.02740, 25000=0.02640, 50000=0.02600, 50=0.82150, 500=0.60080, 1500=0.56030, 5000=0.51970, 25000=0.50180, 50000=0.49290, 50=0.09330, 500=0.06830, 1500=0.06370, 5000=0.05910, 25000=0.05700, 50000=0.05600, 50=0.01420, 500=0.01040, 1500=0.00970, 5000=0.00900, 25000=0.00870, 50000=0.00850, 50=0.01042, 500=0.00762, 1500=0.00710, 5000=0.00659, 25000=0.00636, 50000=0.00625 (AUD); Mount: Surface Mount; Case/Package: 0805; Case Code (Imperial): 0805; Case Code (Metric): 2012; Contact Plating: Tin; Min Operating Temperature: -55°C; Max Operating Temperature: 155°C; Tolerance: 1%; Packaging: Tape and Reel; Termination: SMD/SMT; Resistor Type: Thick Film; Package Quantity: 5000; Voltage Rating (DC): 150V; Length: 2mm; Height: 0.5mm; Width: 1.25mm; Depth: 1.25mm; Thickness: 508um; Radiation Hardening: No; Military Standard: Not; REACH SVHC: No SVHC; ComponentLink1URL: https://datasheet.ciiva.com/9122/chpreztr-9122213.pdf?src-supplier=Avnet; ComponentLink1Description: https://datasheet.ciiva.com/9122/chpreztr-9122213.pdf?src-supplier=Avnet; ComponentLink2URL: https://datasheet.ciiva.com/5542/chpreztr-5542809.pdf?src-supplier=Mouser; ComponentLink2Description: https://datasheet.ciiva.com/5542/chpreztr-5542809.pdf?src-supplier=Mouser; ComponentLink3URL: https://datasheet.ciiva.com/16926/chpreztr-16926206.pdf?src-supplier=Avnet+Europe; ComponentLink3Description: https://datasheet.ciiva.com/16926/chpreztr-16926206.pdf?src-supplier=Avnet+Europe; Supplier 2: Digi-Key; Supplier Part Number 2: 118-CR0805-FX-1202ELFCT-ND; Stock 2: 14509; Pricing 2: 1=0.10000, 10=0.06900, 100=0.02650, 1000=0.01166, 2500=0.01007 (USD)
R4 R8 R9 = Resistor: PANASONIC - ERJ6ENF4700V - RES, 470R, 1%, 0.125W, 0805, THICK FILM; Manufacturer Part Number: ERJ-6ENF4700V; Value: 12k; Temperature Coefficient: 100ppm/°C; Power Rating: 125mW; Voltage Rating: 150V; Supplier 1: LCSC; Supplier Part Number 1: C413274; Manufacturer: Panasonic; RoHS: Yes; Category: Chip SMD Resistors; Stock 1: 32200; Pricing 1: 50=0.01540, 500=0.01130, 1500=0.01060, 5000=0.00980, 25000=0.00950, 50000=0.00930, 50=0.01450, 500=0.01060, 1500=0.00990, 5000=0.00920, 25000=0.00890, 50000=0.00880, 50=0.07400, 500=0.05430, 1500=0.05070, 5000=0.04710, 25000=0.04540, 50000=0.04460, 50=0.06940, 500=0.05090, 1500=0.04750, 5000=0.04410, 25000=0.04260, 50000=0.04190, 50=0.00930, 500=0.00680, 1500=0.00640, 5000=0.00590, 25000=0.00570, 50000=0.00560, 50=0.00850, 500=0.00620, 1500=0.00580, 5000=0.00540, 25000=0.00520, 50000=0.00510, 50=0.08400, 500=0.06170, 1500=0.05750, 5000=0.05340, 25000=0.05160, 50000=0.05070, 50=1.14480, 500=0.84000, 1500=0.78400, 5000=0.72810, 25000=0.70310, 50000=0.69090, 50=0.04520, 500=0.03320, 1500=0.03100, 5000=0.02880, 25000=0.02780, 50000=0.02730, 50=0.84730, 500=0.62170, 1500=0.58020, 5000=0.53880, 25000=0.52040, 50000=0.51130, 50=0.09900, 500=0.07270, 1500=0.06780, 5000=0.06300, 25000=0.06080, 50000=0.05980, 50=0.01490, 500=0.01100, 1500=0.01020, 5000=0.00950, 25000=0.00920, 50000=0.00900, 50=0.01084, 500=0.00796, 1500=0.00743, 5000=0.00690, 25000=0.00666, 50000=0.00654 (AUD); Mount: Surface Mount; Case/Package: 0805; Number of Pins: 2; Weight: 0.000194oz; Case Code (Metric): 2012; Case Code (Imperial): 0805; Contact Plating: Tin; Min Operating Temperature: -55°C; Max Operating Temperature: 155°C; Resistance: 470R; Tolerance: 1%; Packaging: Tape and Reel; Resistor Type: Thick Film; Termination: SMD/SMT; Voltage Rating (DC): 150V; Package Quantity: 1; Number of Terminations: 2; Max Power Dissipation: 125mW; Features: Automotive AEC-Q200; Length: 2mm; Height: 0.6mm; Width: 0.049inch; Depth: 1.25mm; Radiation Hardening: No; Lead Free: Lead Free; Military Standard: Not; REACH SVHC: No SVHC; ComponentLink1URL: https://datasheet.ciiva.com/11821/0900766b80f80784-11821642.pdf?src-supplier=RSComponents; ComponentLink1Description: https://datasheet.ciiva.com/11821/0900766b80f80784-11821642.pdf?src-supplier=RSComponents; ComponentLink2URL: https://datasheet.ciiva.com/34303/1989332-34303633.pdf?src-supplier=Jameco; ComponentLink2Description: https://datasheet.ciiva.com/34303/1989332-34303633.pdf?src-supplier=Jameco; ComponentLink3URL: https://datasheet.ciiva.com/9181/aoa0000ce2-9181798.pdf?src-supplier=Avnet; ComponentLink3Description: https://datasheet.ciiva.com/9181/aoa0000ce2-9181798.pdf?src-supplier=Avnet; ComponentLink4URL: https://datasheet.ciiva.com/16767/70260748-16767755.pdf?src-supplier=Allied+Electronics; ComponentLink4Description: https://datasheet.ciiva.com/16767/70260748-16767755.pdf?src-supplier=Allied+Electronics; ComponentLink5URL: https://datasheet.ciiva.com/22687/1678782-22687451.pdf?src-supplier=Element14; ComponentLink5Description: https://datasheet.ciiva.com/22687/1678782-22687451.pdf?src-supplier=Element14; ComponentLink6URL: https://datasheet.ciiva.com/7830/426256-7830749.pdf?src-supplier=Element14; ComponentLink6Description: https://datasheet.ciiva.com/7830/426256-7830749.pdf?src-supplier=Element14; ComponentLink7URL: https://datasheet.ciiva.com/16783/70260748-16783246.pdf?src-supplier=Allied+Electronics; ComponentLink7Description: https://datasheet.ciiva.com/16783/70260748-16783246.pdf?src-supplier=Allied+Electronics; ComponentLink8URL: https://datasheet.ciiva.com/7830/1678782-7830991.pdf?src-supplier=Element14; ComponentLink8Description: https://datasheet.ciiva.com/7830/1678782-7830991.pdf?src-supplier=Element14; ComponentLink9URL: https://datasheet.ciiva.com/17205/aoa0000ce2-17205551.pdf?src-supplier=Avnet+Europe; ComponentLink9Description: https://datasheet.ciiva.com/17205/aoa0000ce2-17205551.pdf?src-supplier=Avnet+Europe; ComponentLink10URL: https://datasheet.ciiva.com/24124/aoa0000ce2-24124316.pdf?src-supplier=Mouser; ComponentLink10Description: https://datasheet.ciiva.com/24124/aoa0000ce2-24124316.pdf?src-supplier=Mouser; ComponentLink11URL: https://datasheet.ciiva.com/22668/1678782-22668335.pdf?src-supplier=Element14; ComponentLink11Description: https://datasheet.ciiva.com/22668/1678782-22668335.pdf?src-supplier=Element14; Supplier 2: Digi-Key; Supplier Part Number 2: P470CCT-ND; Stock 2: 151505; Pricing 2: 1=0.10000, 10=0.06500, 100=0.02500, 1000=0.01100, 2500=0.00950 (USD)
R6 R10 = Resistor: Resistor; Thick Film; Res 200 Ohms; Pwr-Rtg 0.125 W; Tol 1%; SMT; 0805; Cut Tape; Manufacturer: Panasonic; Manufacturer Part Number: ERJ-6ENF2000V; Temperature Coefficient: 100ppm/°C; Power Rating: 125mW; Voltage Rating: 150V; Value: 200R; Supplier 1: LCSC; Supplier Part Number 1: C413268; RoHS: Yes; Category: Chip SMD Resistors; Stock 1: 5800; Pricing 1: 50=0.01480, 500=0.01080, 1500=0.01010, 5000=0.00940, 25000=0.00900, 50000=0.00890, 50=0.01420, 500=0.01040, 1500=0.00970, 5000=0.00900, 25000=0.00860, 50000=0.00850, 50=0.07210, 500=0.05270, 1500=0.04910, 5000=0.04560, 25000=0.04400, 50000=0.04320, 50=0.06710, 500=0.04900, 1500=0.04570, 5000=0.04240, 25000=0.04090, 50000=0.04020, 50=0.00900, 500=0.00660, 1500=0.00610, 5000=0.00570, 25000=0.00550, 50000=0.00540, 50=0.00820, 500=0.00600, 1500=0.00560, 5000=0.00520, 25000=0.00500, 50000=0.00490, 50=0.08200, 500=0.05990, 1500=0.05590, 5000=0.05180, 25000=0.05000, 50000=0.04910, 50=1.11830, 500=0.81730, 1500=0.76200, 5000=0.70680, 25000=0.68220, 50000=0.67010, 50=0.04400, 500=0.03210, 1500=0.03000, 5000=0.02780, 25000=0.02680, 50000=0.02640, 50=0.83460, 500=0.61000, 1500=0.56870, 5000=0.52750, 25000=0.50920, 50000=0.50010, 50=0.09480, 500=0.06930, 1500=0.06460, 5000=0.05990, 25000=0.05790, 50000=0.05680, 50=0.01450, 500=0.01060, 1500=0.00990, 5000=0.00910, 25000=0.00880, 50000=0.00870, 50=0.01058, 500=0.00773, 1500=0.00721, 5000=0.00669, 25000=0.00646, 50000=0.00634 (AUD); Mount: Surface Mount; Case/Package: 0805; Weight: 0.000194oz; Case Code (Imperial): 0805; Case Code (Metric): 2012; Contact Plating: Tin; Min Operating Temperature: -55°C; Max Operating Temperature: 155°C; Resistance: 200R; Tolerance: 1%; Packaging: Tape and Reel; Termination: SMD/SMT; Resistor Type: Thick Film; Voltage Rating (DC): 150V; Package Quantity: 1; Number of Terminations: 2; Max Power Dissipation: 125mW; Features: Automotive AEC-Q200; Length: 2mm; Height: 0.6mm; Width: 1.2mm; Depth: 1.25mm; Radiation Hardening: No; Lead Free: Lead Free; REACH SVHC: No SVHC; Military Standard: Not; ComponentLink1URL: https://datasheet.ciiva.com/34303/1989113-34303623.pdf?src-supplier=Jameco; ComponentLink1Description: https://datasheet.ciiva.com/34303/1989113-34303623.pdf?src-supplier=Jameco; ComponentLink2URL: https://datasheet.ciiva.com/11821/0900766b80f80784-11821567.pdf?src-supplier=RSComponents; ComponentLink2Description: https://datasheet.ciiva.com/11821/0900766b80f80784-11821567.pdf?src-supplier=RSComponents; ComponentLink3URL: https://datasheet.ciiva.com/28691/1678782-28691975.pdf?src-supplier=Element14; ComponentLink3Description: https://datasheet.ciiva.com/28691/1678782-28691975.pdf?src-supplier=Element14; ComponentLink4URL: https://datasheet.ciiva.com/9117/aoa0000ce2-9117436.pdf?src-supplier=Avnet; ComponentLink4Description: https://datasheet.ciiva.com/9117/aoa0000ce2-9117436.pdf?src-supplier=Avnet; ComponentLink5URL: https://datasheet.ciiva.com/43460/426256-43460012.pdf?src-supplier=Farnell; ComponentLink5Description: https://datasheet.ciiva.com/43460/426256-43460012.pdf?src-supplier=Farnell; ComponentLink6URL: https://datasheet.ciiva.com/6137/426256-6137576.pdf?src-supplier=Farnell; ComponentLink6Description: https://datasheet.ciiva.com/6137/426256-6137576.pdf?src-supplier=Farnell; ComponentLink7URL: https://datasheet.ciiva.com/16778/70260748-16778890.pdf?src-supplier=Allied+Electronics; ComponentLink7Description: https://datasheet.ciiva.com/16778/70260748-16778890.pdf?src-supplier=Allied+Electronics; ComponentLink8URL: https://datasheet.ciiva.com/24158/aoa0000ce2-24158747.pdf?src-supplier=Mouser; ComponentLink8Description: https://datasheet.ciiva.com/24158/aoa0000ce2-24158747.pdf?src-supplier=Mouser; ComponentLink9URL: https://datasheet.ciiva.com/17207/aoa0000ce2-17207021.pdf?src-supplier=Avnet+Europe; ComponentLink9Description: https://datasheet.ciiva.com/17207/aoa0000ce2-17207021.pdf?src-supplier=Avnet+Europe; ComponentLink10URL: https://datasheet.ciiva.com/16775/70260748-16775615.pdf?src-supplier=Allied+Electronics; ComponentLink10Description: https://datasheet.ciiva.com/16775/70260748-16775615.pdf?src-supplier=Allied+Electronics; Supplier 2: Digi-Key; Supplier Part Number 2: P200CCT-ND; Stock 2: 357528; Pricing 2: 1=0.10000, 10=0.06500, 100=0.02500, 1000=0.01100, 2500=0.00950 (USD)
U1 = CMP-194065-000003-1: WIFI MODULE 32MBITS SPI FLASH; Manufacturer: Espressif Systems; Max Supply Voltage: 3.6V; Nominal Supply Current: 500mA; Max Frequency: 2484MHz; Number Of Adc Channels: 16; Number Of Gpio: 32; Interface: I2C,SPI,UART,Ethernet,I2S,Other; Data Rate: 150Mbits/s; Min Supply Voltage: 3V; Bandwidth: 72MHz; Sensitivity: -98dBm; Frequency: 2.5GHz; Memory Size: 536KB; Octopart: https://octopart.com/esp32-wroom-32d-espressif+systems-91040050; Package: ESP32-WROOM-32D; ComponentLink2URL: https://www.espressif.com/sites/default/files/documentation/esp32-wroom-32d_esp32-wroom-32u_datasheet_en.pdf; Lead Free: Yes; Category: UNK; Mouser Description: Wi-Fi/BT BLE Module ESP32-D0WD, SPI Flash, UART, P; Device Class L1: Integrated Circuits (ICs); RoHS: TRUE; Temperature Range Low: -40°C; ComponentLink2Description: Datasheet; Digikey Description: WIFI MODULE 32MBITS SPI FLASH; Height: 3.2mm; Temperature: -40°C to +85°C; Manufacturer Part Number: ESP32-WROOM-32D; Device Class L3: Transceivers; Device Class L2: RF Semiconductors and Devices; Temperature Range High: +85°C; Automotive: No; Supplier 1: Digi-Key; Supplier Part Number 1: 1904-1023-6-ND; Stock 1: 7571; Pricing 1: 1=3.80000 (USD); Mount: Surface Mount; Case/Package: SMD/SMT; Min Operating Temperature: -40°C; Max Operating Temperature: 85°C; Packaging: Cut Tape; ComponentLink1URL: https://www.espressif.com/sites/default/files/documentation/esp32-wroom-32d_esp32-wroom-32u_datasheet_en.pdf?src-supplier=Digi-Key; ComponentLink1Description: https://www.espressif.com/sites/default/files/documentation/esp32-wroom-32d_esp32-wroom-32u_datasheet_en.pdf?src-supplier=Digi-Key; Supplier 2: LCSC; Supplier Part Number 2: C473012
U2 = CMP-2000-04924-1: Single-Chip USB to URAT Bridge, 3.3 V, -40 to 85 degC, 28-Pin QFN, RoHS, Tape and Reel; Manufacturer: Silicon Labs; Interface Circuit Standard 1: RS-232; Transmitter and Receiver FIFO Counter: No; Supply Current: 26mA; Operating Supply Voltage (Min): 3V; Operating Supply Voltage (Typ): 3.3V; Data Rate: 1000kbps; Operating Supply Voltage (Max): 3.6V; Number of Channels: 1; Interface: UART; Operating Supply Current: 20mA; Package URL: http://www.silabs.com/Support%20Documents/TechnicalDocs/C8051T61x.pdf; Operating Temperature (Max): 85C; Datasheet URL: http://www.mouser.com/ds/2/368/CP2102-9-247052.pdf; Operating Temperature Classification: Industrial; Operating Temperature (Min): -40C; Package Description: 28-Pin Quad-Flat No-Leads Package, Body 5 x 5 mm, Pitch 0.5 mm; Manufacturer URL: http://www.silabs.com/; Rad Hardened: No; Package Reference: QFN-28; Pin Count: 28; Packaging: TapeandReel; Mounting: SurfaceMount; Package Type: QFNEP; Datasheet Version: Rev. 1.6, 12/2013; Supplier 1: LCSC; Supplier Part Number 1: C6568; Manufacturer Part Number: CP2102-GMR; RoHS: Yes; Category: Interface ICs; Stock 1: 5948; Pricing 1: 1=2.37280, 10=1.73630, 30=1.62220, 100=1.50580, 500=1.43050, 1000=1.41680, 1=2.28200, 10=1.66980, 30=1.56010, 100=1.44820, 500=1.37580, 1000=1.36260, 1=11.76860, 10=8.61150, 30=8.04570, 100=7.46860, 500=7.09510, 1000=7.02720, 1=10.85900, 10=7.94590, 30=7.42380, 100=6.89130, 500=6.54670, 1000=6.48410, 1=1.45950, 10=1.06790, 30=0.99780, 100=0.92620, 500=0.87990, 1000=0.87150, 1=1.35080, 10=0.98840, 30=0.92340, 100=0.85720, 500=0.81430, 1000=0.80660, 1=13.43340, 10=9.82960, 30=9.18380, 100=8.52510, 500=8.09880, 1000=8.02130, 1=183.15440, 10=134.01970, 30=125.21420, 100=116.23260, 500=110.42100, 1000=109.36430, 1=7.17510, 10=5.25030, 30=4.90530, 100=4.55350, 500=4.32580, 1000=4.28440, 1=130.38720, 10=95.40830, 30=89.13970, 100=82.74580, 500=78.60850, 1000=77.85620, 1=15.20060, 10=11.12270, 30=10.39190, 100=9.64650, 500=9.16420, 1000=9.07650, 1=2.36150, 10=1.72800, 30=1.61450, 100=1.49870, 500=1.42370, 1000=1.41010, 1=1.73333, 10=1.26833, 30=1.18500, 100=1.10000, 500=1.04500, 1000=1.03500 (AUD); Mount: Surface Mount; Case/Package: QFN; Number of Pins: 28; Weight: 0.00239oz; Contact Plating: Tin; Min Operating Temperature: -40°C; Max Operating Temperature: 85°C; Max Supply Voltage: 3.6V; Package Quantity: 1500; Min Supply Voltage: 3V; Nominal Supply Current: 26mA; Radiation Hardening: No; Lead Free: Lead Free; ComponentLink1URL: https://datasheet.ciiva.com/6636/cp2102-9-6636566.pdf?src-supplier=Digi-Key; ComponentLink1Description: https://datasheet.ciiva.com/6636/cp2102-9-6636566.pdf?src-supplier=Digi-Key; ComponentLink2URL: https://datasheet.ciiva.com/6636/cp2102-9-6636571.pdf?src-supplier=Digi-Key; ComponentLink2Description: https://datasheet.ciiva.com/6636/cp2102-9-6636571.pdf?src-supplier=Digi-Key; Supplier 2: Digi-Key; Supplier Part Number 2: 336-1160-1-ND; Stock 2: 15758; Pricing 2: 1=3.17000, 25=3.05560, 100=2.95000 (USD)